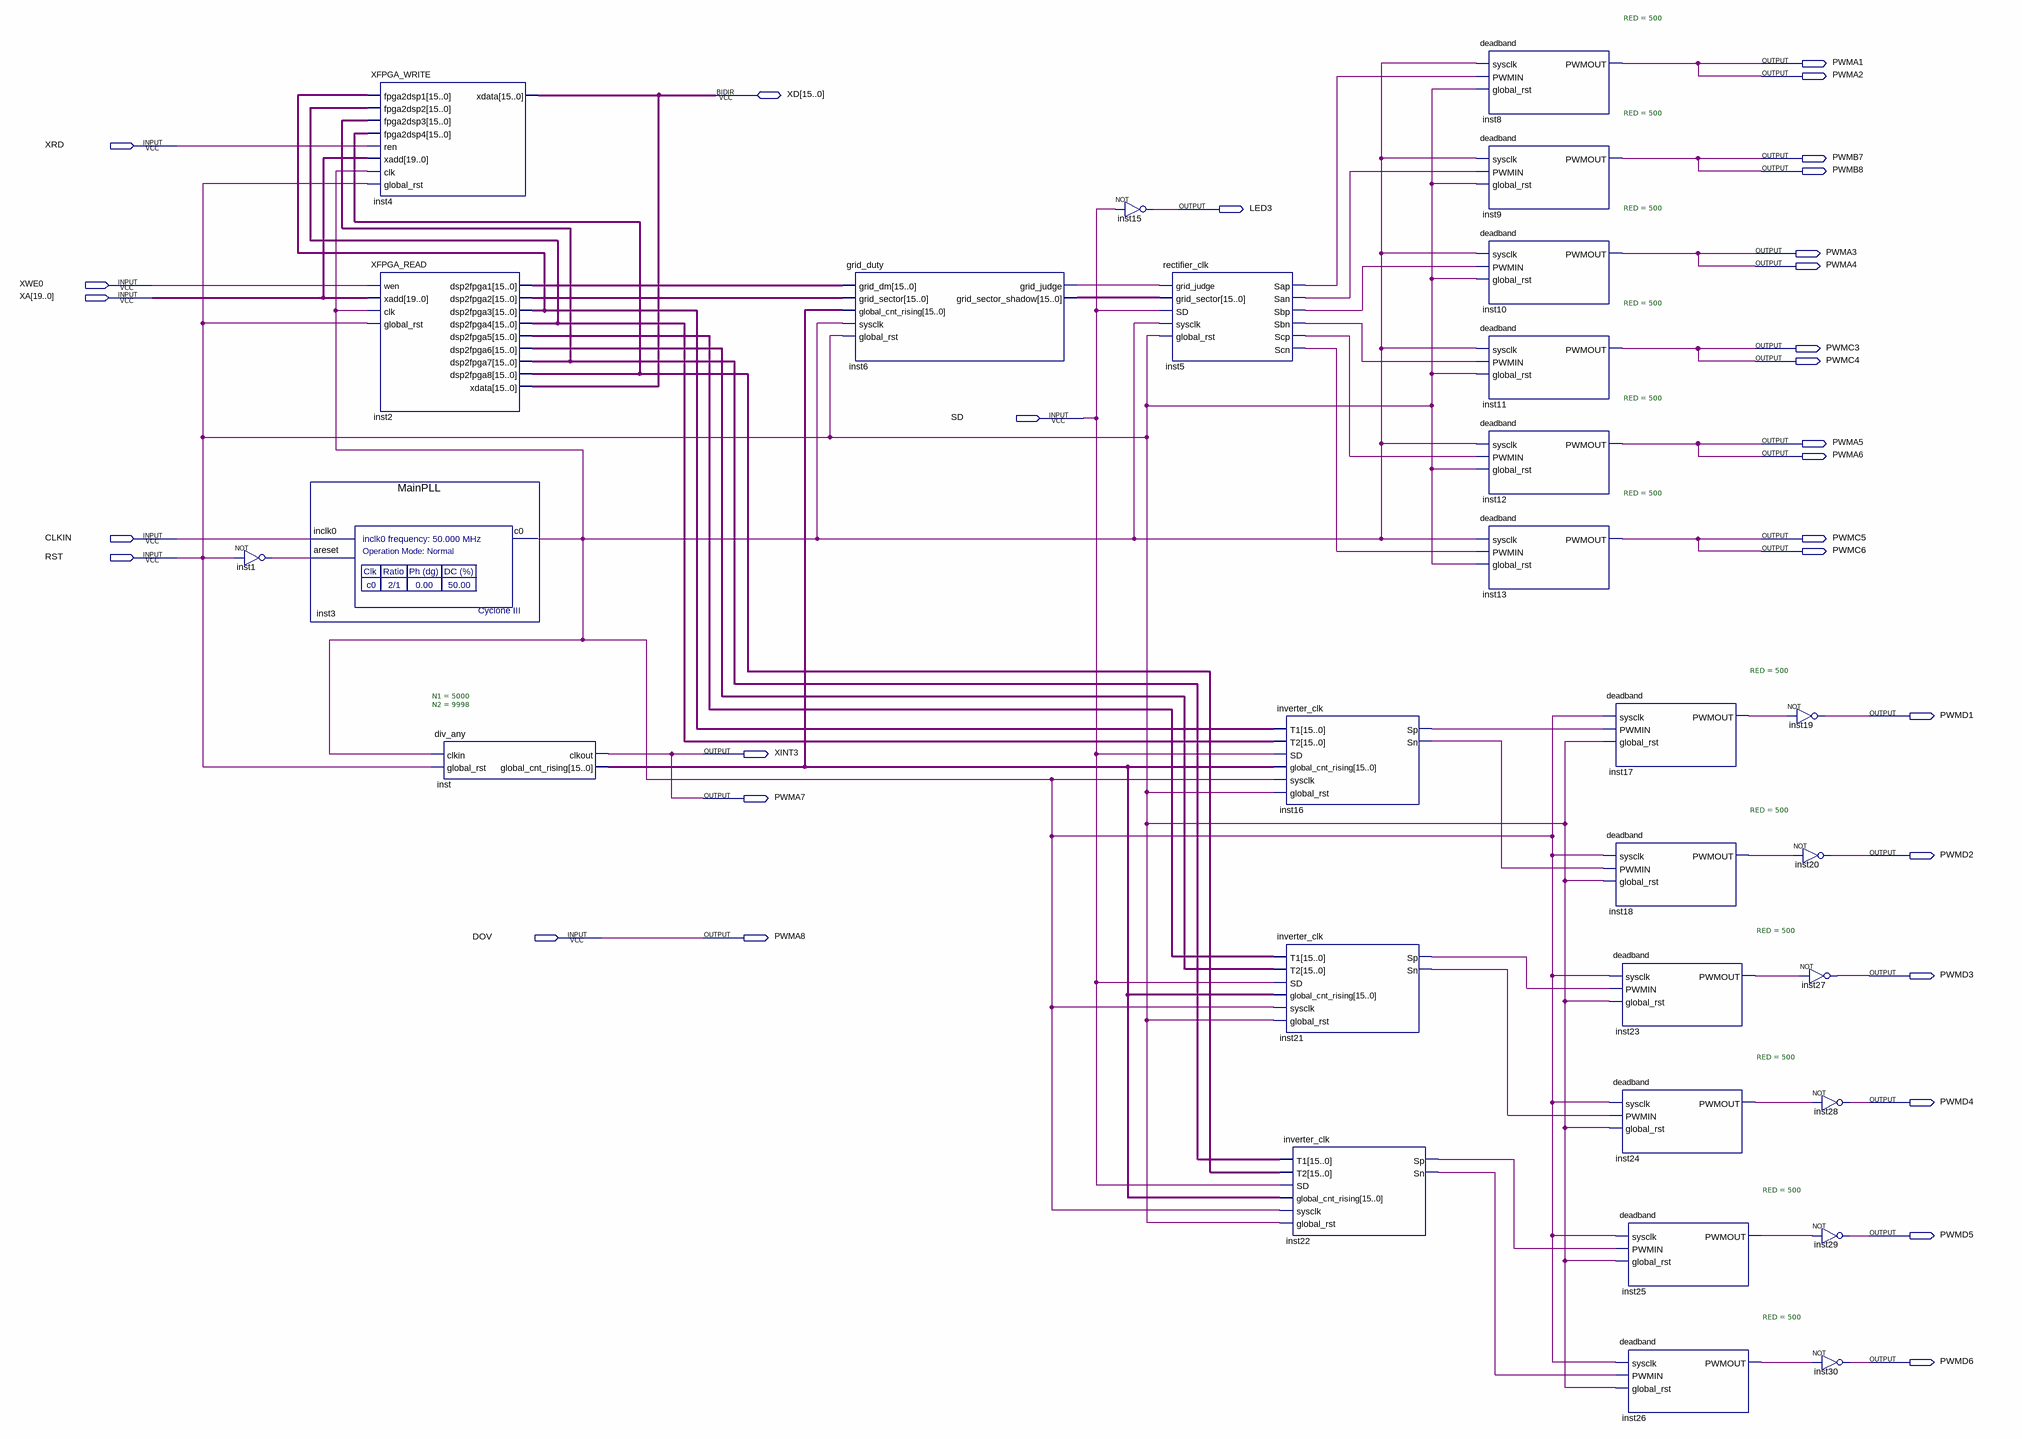
[diagram p0: schematic sheet]
// Quartus schematic DSP_FPGA_IMC_PMSM.bdf as structural Verilog: 29 symbols, 30 pins
module DSP_FPGA_IMC_PMSM (
  input  XRD,
  input  XWE0,
  input  [19:0] XA,
  input  SD,
  input  CLKIN,
  input  RST,
  input  DOV,
  inout  [15:0] XD,
  output PWMA1,
  output PWMA2,
  output PWMB7,
  output PWMB8,
  output LED3,
  output PWMA3,
  output PWMA4,
  output PWMC3,
  output PWMC4,
  output PWMA5,
  output PWMA6,
  output PWMC5,
  output PWMC6,
  output PWMD1,
  output XINT3,
  output PWMA7,
  output PWMD2,
  output PWMA8,
  output PWMD3,
  output PWMD4,
  output PWMD5,
  output PWMD6
);

  wire inst1_out, inst3_c0, inst5_san, inst5_sap, inst5_sbn, inst5_sbp, inst5_scn, inst5_scp,
       inst6_grid_judge, inst16_sn, inst16_sp, inst17_pwmout, inst18_pwmout, inst21_sn, inst21_sp, inst22_sn,
       inst22_sp, inst23_pwmout, inst24_pwmout, inst25_pwmout, inst26_pwmout;
  wire [15:0] inst2_dsp2fpga1, inst2_dsp2fpga2, inst2_dsp2fpga3, inst2_dsp2fpga4, inst2_dsp2fpga5,
       inst2_dsp2fpga6, inst2_dsp2fpga7, inst2_dsp2fpga8, inst6_grid_sector_shadow, inst_global_cnt_rising;

  not inst1 (inst1_out, RST);
  MainPLL inst3 (.inclk0(CLKIN), .areset(inst1_out), .c0(inst3_c0));
  XFPGA_WRITE inst4 (
    .fpga2dsp1(inst2_dsp2fpga3), .fpga2dsp2(inst2_dsp2fpga4), .fpga2dsp3(inst2_dsp2fpga7),
    .fpga2dsp4(inst2_dsp2fpga8), .ren(XRD), .xadd(XA), .clk(inst3_c0), .global_rst(RST), .xdata(XD));
  XFPGA_READ inst2 (
    .wen(XWE0), .xadd(XA), .clk(inst3_c0), .global_rst(RST), .dsp2fpga1(inst2_dsp2fpga1),
    .dsp2fpga2(inst2_dsp2fpga2), .dsp2fpga3(inst2_dsp2fpga3), .dsp2fpga4(inst2_dsp2fpga4),
    .dsp2fpga5(inst2_dsp2fpga5), .dsp2fpga6(inst2_dsp2fpga6), .dsp2fpga7(inst2_dsp2fpga7),
    .dsp2fpga8(inst2_dsp2fpga8), .xdata(XD));
  div_any #(.N1(5000), .N2(9998)) inst (
    .clkin(inst3_c0), .global_rst(RST), .clkout(PWMA7), .global_cnt_rising(inst_global_cnt_rising));
  grid_duty inst6 (
    .grid_dm(inst2_dsp2fpga1), .grid_sector(inst2_dsp2fpga2), .global_cnt_rising(inst_global_cnt_rising),
    .sysclk(inst3_c0), .global_rst(RST), .grid_judge(inst6_grid_judge),
    .grid_sector_shadow(inst6_grid_sector_shadow));
  not inst15 (LED3, SD);
  rectifier_clk inst5 (
    .grid_judge(inst6_grid_judge), .grid_sector(inst6_grid_sector_shadow), .SD(SD), .sysclk(inst3_c0),
    .global_rst(RST), .Sap(inst5_sap), .San(inst5_san), .Sbp(inst5_sbp), .Sbn(inst5_sbn), .Scp(inst5_scp),
    .Scn(inst5_scn));
  inverter_clk inst16 (
    .T1(inst2_dsp2fpga3), .T2(inst2_dsp2fpga4), .SD(SD), .global_cnt_rising(inst_global_cnt_rising),
    .sysclk(inst3_c0), .global_rst(RST), .Sp(inst16_sp), .Sn(inst16_sn));
  inverter_clk inst21 (
    .T1(inst2_dsp2fpga5), .T2(inst2_dsp2fpga6), .SD(SD), .global_cnt_rising(inst_global_cnt_rising),
    .sysclk(inst3_c0), .global_rst(RST), .Sp(inst21_sp), .Sn(inst21_sn));
  inverter_clk inst22 (
    .T1(inst2_dsp2fpga7), .T2(inst2_dsp2fpga8), .SD(SD), .global_cnt_rising(inst_global_cnt_rising),
    .sysclk(inst3_c0), .global_rst(RST), .Sp(inst22_sp), .Sn(inst22_sn));
  deadband #(.RED(500)) inst8 (.sysclk(inst3_c0), .PWMIN(inst5_sap), .global_rst(RST), .PWMOUT(PWMA1));
  deadband #(.RED(500)) inst9 (.sysclk(inst3_c0), .PWMIN(inst5_san), .global_rst(RST), .PWMOUT(PWMB7));
  deadband #(.RED(500)) inst10 (.sysclk(inst3_c0), .PWMIN(inst5_sbp), .global_rst(RST), .PWMOUT(PWMA3));
  deadband #(.RED(500)) inst11 (.sysclk(inst3_c0), .PWMIN(inst5_sbn), .global_rst(RST), .PWMOUT(PWMC3));
  deadband #(.RED(500)) inst12 (.sysclk(inst3_c0), .PWMIN(inst5_scp), .global_rst(RST), .PWMOUT(PWMA5));
  deadband #(.RED(500)) inst13 (.sysclk(inst3_c0), .PWMIN(inst5_scn), .global_rst(RST), .PWMOUT(PWMC5));
  deadband #(.RED(500)) inst17 (.sysclk(inst3_c0), .PWMIN(inst16_sp), .global_rst(RST), .PWMOUT(inst17_pwmout));
  deadband #(.RED(500)) inst18 (.sysclk(inst3_c0), .PWMIN(inst16_sn), .global_rst(RST), .PWMOUT(inst18_pwmout));
  deadband #(.RED(500)) inst23 (.sysclk(inst3_c0), .PWMIN(inst21_sp), .global_rst(RST), .PWMOUT(inst23_pwmout));
  deadband #(.RED(500)) inst24 (.sysclk(inst3_c0), .PWMIN(inst21_sn), .global_rst(RST), .PWMOUT(inst24_pwmout));
  deadband #(.RED(500)) inst25 (.sysclk(inst3_c0), .PWMIN(inst22_sp), .global_rst(RST), .PWMOUT(inst25_pwmout));
  deadband #(.RED(500)) inst26 (.sysclk(inst3_c0), .PWMIN(inst22_sn), .global_rst(RST), .PWMOUT(inst26_pwmout));
  not inst19 (PWMD1, inst17_pwmout);
  not inst20 (PWMD2, inst18_pwmout);
  not inst27 (PWMD3, inst23_pwmout);
  not inst28 (PWMD4, inst24_pwmout);
  not inst29 (PWMD5, inst25_pwmout);
  not inst30 (PWMD6, inst26_pwmout);

  assign PWMA2 = PWMA1;
  assign PWMA4 = PWMA3;
  assign PWMA6 = PWMA5;
  assign PWMA8 = DOV;
  assign PWMB8 = PWMB7;
  assign PWMC4 = PWMC3;
  assign PWMC6 = PWMC5;
  assign XINT3 = PWMA7;
endmodule
